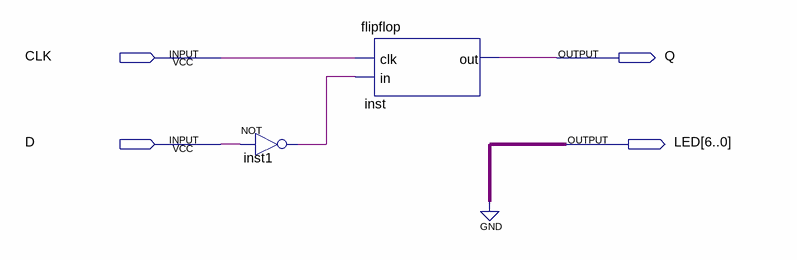
[diagram p0: schematic sheet]
// Quartus schematic top.bdf as structural Verilog: 2 symbols, 4 pins
module top (
  input  CLK,
  input  D,
  output Q,
  output [6:0] LED
);

  wire inst1_out;

  not inst1 (inst1_out, D);
  flipflop inst (.clk(CLK), .in(inst1_out), .out(Q));

  assign LED = {7{1'b0}};
endmodule
